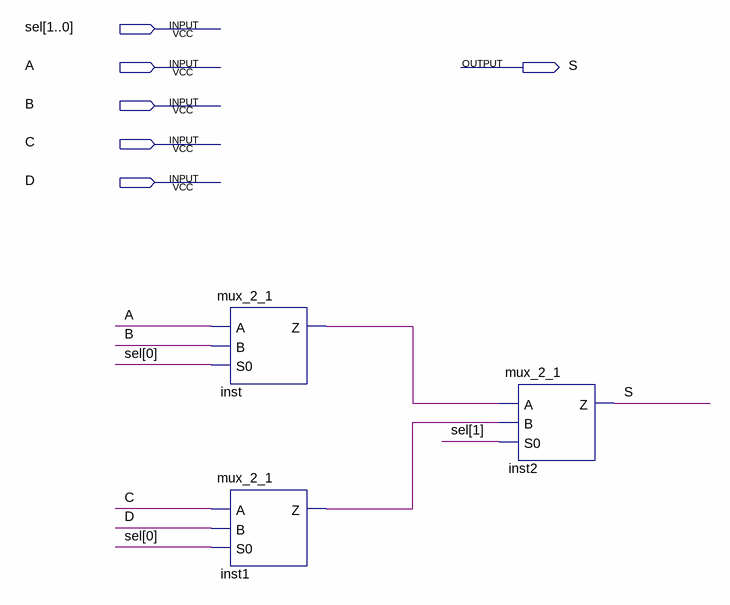
[diagram p0: schematic sheet]
// Quartus schematic mux_4x1_1b.bdf as structural Verilog: 3 symbols, 6 pins
module mux_4x1_1b (
  input  [1:0] sel,
  input  A,
  input  B,
  input  C,
  input  D,
  output S
);

  wire inst1_z, inst_z;

  mux_2_1 inst (.A(A), .B(B), .S0(sel[0]), .Z(inst_z));
  mux_2_1 inst1 (.A(C), .B(D), .S0(sel[0]), .Z(inst1_z));
  mux_2_1 inst2 (.A(inst_z), .B(inst1_z), .S0(sel[1]), .Z(S));
endmodule
